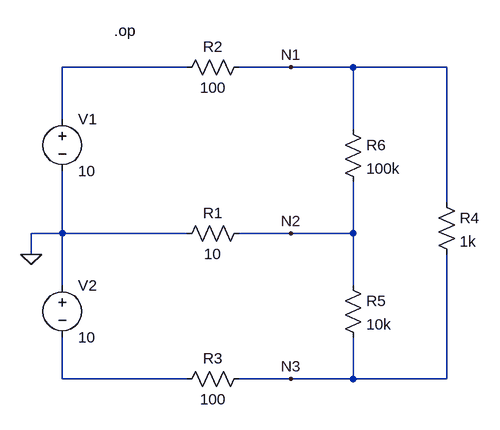
[diagram p0: schematic circuit3.asc]
circuit3.asc, the LTspice schematic file:
Version 4
SHEET 1 1372 680
WIRE 368 48 176 48
WIRE 528 48 448 48
WIRE 624 48 528 48
WIRE 768 48 624 48
WIRE 176 128 176 48
WIRE 624 144 624 48
WIRE 768 256 768 48
WIRE 176 304 176 208
WIRE 176 304 128 304
WIRE 368 304 176 304
WIRE 528 304 448 304
WIRE 624 304 624 224
WIRE 624 304 528 304
WIRE 128 336 128 304
WIRE 176 384 176 304
WIRE 624 384 624 304
WIRE 176 528 176 464
WIRE 368 528 176 528
WIRE 528 528 448 528
WIRE 624 528 624 464
WIRE 624 528 528 528
WIRE 768 528 768 336
WIRE 768 528 624 528
FLAG 128 336 0
FLAG 528 48 N1
FLAG 528 304 N2
FLAG 528 528 N3
SYMBOL voltage 176 112 R0
SYMATTR InstName V1
SYMATTR Value 10
SYMBOL res 352 64 R270
WINDOW 0 32 56 VTop 2
WINDOW 3 0 56 VBottom 2
SYMATTR InstName R2
SYMATTR Value 100
SYMBOL res 352 320 R270
WINDOW 0 32 56 VTop 2
WINDOW 3 0 56 VBottom 2
SYMATTR InstName R1
SYMATTR Value 10
SYMBOL res 464 512 R90
WINDOW 0 0 56 VBottom 2
WINDOW 3 32 56 VTop 2
SYMATTR InstName R3
SYMATTR Value 100
SYMBOL voltage 176 368 R0
SYMATTR InstName V2
SYMATTR Value 10
SYMBOL res 608 128 R0
SYMATTR InstName R6
SYMATTR Value 100k
SYMBOL res 608 368 R0
SYMATTR InstName R5
SYMATTR Value 10k
SYMBOL res 752 240 R0
SYMATTR InstName R4
SYMATTR Value 1k
TEXT 256 -8 Left 2 !.op

The netlist it stands for:
* circuit3.asc
V1 N001 0 10
R2 N001 N1 100
R1 0 N2 10
R3 N3 N002 100
V2 0 N002 10
R6 N1 N2 100k
R5 N2 N3 10k
R4 N1 N3 1k
.op
.backanno
.end